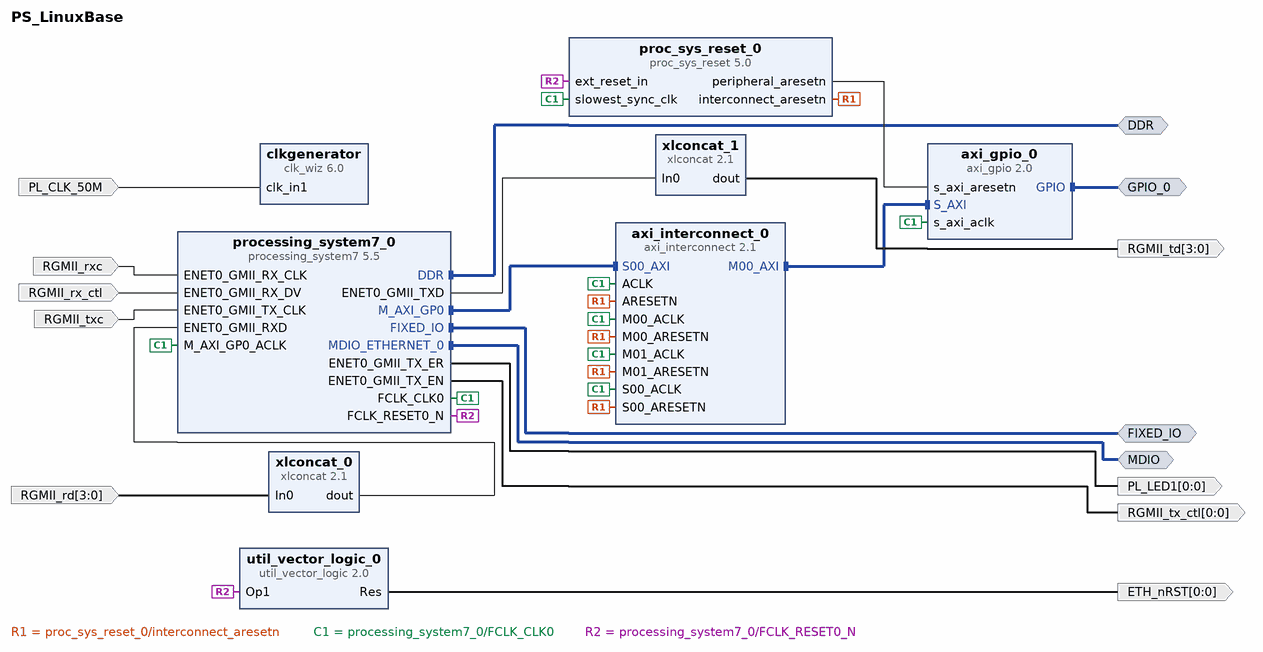
[diagram p0: block diagram of the top level]
# Vivado block design PS_LinuxBase, xc7z020clg400-2, Vivado 2022.1
create_bd_design PS_LinuxBase

create_bd_intf_port -mode Master -vlnv xilinx.com:interface:ddrx_rtl:1.0 DDR
create_bd_intf_port -mode Master -vlnv xilinx.com:display_processing_system7:fixedio_rtl:1.0 FIXED_IO
create_bd_intf_port -mode Master -vlnv xilinx.com:interface:mdio_rtl:1.0 MDIO
create_bd_intf_port -mode Master -vlnv xilinx.com:interface:gpio_rtl:1.0 GPIO_0
create_bd_port -dir I -type clk PL_CLK_50M
set_property -dict {CONFIG.ASSOCIATED_RESET ETH_nRST CONFIG.FREQ_HZ 50000000} [get_bd_ports PL_CLK_50M]
create_bd_port -dir O -from 0 -to 0 PL_LED1
create_bd_port -dir O -from 0 -to 0 -type rst ETH_nRST
create_bd_port -dir O -from 3 -to 0 RGMII_td
create_bd_port -dir I -type clk RGMII_txc
set_property -dict {CONFIG.FREQ_HZ 25000000} [get_bd_ports RGMII_txc]
create_bd_port -dir I RGMII_rx_ctl
create_bd_port -dir O -from 0 -to 0 RGMII_tx_ctl
create_bd_port -dir I -type clk RGMII_rxc
set_property -dict {CONFIG.FREQ_HZ 25000000} [get_bd_ports RGMII_rxc]
create_bd_port -dir I -from 3 -to 0 RGMII_rd

create_bd_cell -type ip -vlnv xilinx.com:ip:clk_wiz:6.0 clkgenerator
set_property -dict [list \
  CONFIG.CLKIN1_JITTER_PS 200.0 \
  CONFIG.CLKOUT1_DRIVES BUFG \
  CONFIG.CLKOUT1_JITTER 162.035 \
  CONFIG.CLKOUT1_PHASE_ERROR 164.985 \
  CONFIG.CLKOUT2_DRIVES BUFG \
  CONFIG.CLKOUT2_JITTER 154.207 \
  CONFIG.CLKOUT2_PHASE_ERROR 164.985 \
  CONFIG.CLKOUT2_REQUESTED_OUT_FREQ 125 \
  CONFIG.CLKOUT2_USED true \
  CONFIG.CLKOUT3_DRIVES BUFG \
  CONFIG.CLKOUT3_JITTER 142.107 \
  CONFIG.CLKOUT3_PHASE_ERROR 164.985 \
  CONFIG.CLKOUT3_REQUESTED_OUT_FREQ 200 \
  CONFIG.CLKOUT3_USED true \
  CONFIG.CLKOUT4_DRIVES BUFG \
  CONFIG.CLKOUT5_DRIVES BUFG \
  CONFIG.CLKOUT6_DRIVES BUFG \
  CONFIG.CLKOUT7_DRIVES BUFG \
  CONFIG.CLK_OUT1_PORT CLK_100M \
  CONFIG.CLK_OUT2_PORT CLK_125M \
  CONFIG.CLK_OUT3_PORT CLK_200M \
  CONFIG.FEEDBACK_SOURCE FDBK_AUTO \
  CONFIG.MMCM_BANDWIDTH OPTIMIZED \
  CONFIG.MMCM_CLKFBOUT_MULT_F 20.000 \
  CONFIG.MMCM_CLKIN1_PERIOD 20.000 \
  CONFIG.MMCM_CLKIN2_PERIOD 10.0 \
  CONFIG.MMCM_CLKOUT0_DIVIDE_F 10.000 \
  CONFIG.MMCM_CLKOUT1_DIVIDE 8 \
  CONFIG.MMCM_CLKOUT2_DIVIDE 5 \
  CONFIG.MMCM_COMPENSATION ZHOLD \
  CONFIG.NUM_OUT_CLKS 3 \
  CONFIG.PRIMITIVE MMCM \
  CONFIG.PRIM_IN_FREQ 50 \
  CONFIG.USE_RESET false \
] [get_bd_cells clkgenerator]
create_bd_cell -type ip -vlnv xilinx.com:ip:processing_system7:5.5 processing_system7_0
set_property -dict [list \
  CONFIG.PCW_ENET0_ENET0_IO EMIO \
  CONFIG.PCW_ENET0_GRP_MDIO_ENABLE 1 \
  CONFIG.PCW_ENET0_GRP_MDIO_IO EMIO \
  CONFIG.PCW_ENET0_PERIPHERAL_ENABLE 1 \
  CONFIG.PCW_ENET0_PERIPHERAL_FREQMHZ {100 Mbps} \
  CONFIG.PCW_ENET_RESET_ENABLE 0 \
  CONFIG.PCW_EN_CLK1_PORT 1 \
  CONFIG.PCW_EN_CLK2_PORT 1 \
  CONFIG.PCW_EN_CLK3_PORT 1 \
  CONFIG.PCW_FCLK_CLK1_BUF TRUE \
  CONFIG.PCW_FCLK_CLK2_BUF TRUE \
  CONFIG.PCW_FCLK_CLK3_BUF TRUE \
  CONFIG.PCW_FPGA0_PERIPHERAL_FREQMHZ 100 \
  CONFIG.PCW_FPGA1_PERIPHERAL_FREQMHZ 125 \
  CONFIG.PCW_FPGA2_PERIPHERAL_FREQMHZ 200 \
  CONFIG.PCW_FPGA3_PERIPHERAL_FREQMHZ 25 \
  CONFIG.PCW_FPGA_FCLK1_ENABLE 1 \
  CONFIG.PCW_FPGA_FCLK2_ENABLE 1 \
  CONFIG.PCW_FPGA_FCLK3_ENABLE 1 \
  CONFIG.PCW_GPIO_MIO_GPIO_ENABLE 1 \
  CONFIG.PCW_GPIO_MIO_GPIO_IO MIO \
  CONFIG.PCW_I2C_RESET_ENABLE 1 \
  CONFIG.PCW_IRQ_F2P_INTR 1 \
  CONFIG.PCW_PRESET_BANK1_VOLTAGE {LVCMOS 3.3V} \
  CONFIG.PCW_QSPI_GRP_SINGLE_SS_ENABLE 1 \
  CONFIG.PCW_QSPI_GRP_SINGLE_SS_IO {MIO 1 .. 6} \
  CONFIG.PCW_QSPI_PERIPHERAL_ENABLE 1 \
  CONFIG.PCW_QSPI_QSPI_IO {MIO 1 .. 6} \
  CONFIG.PCW_SD0_GRP_CD_ENABLE 0 \
  CONFIG.PCW_SD0_GRP_WP_ENABLE 0 \
  CONFIG.PCW_SD0_PERIPHERAL_ENABLE 1 \
  CONFIG.PCW_SD0_SD0_IO {MIO 40 .. 45} \
  CONFIG.PCW_SDIO_PERIPHERAL_FREQMHZ 100 \
  CONFIG.PCW_SINGLE_QSPI_DATA_MODE x4 \
  CONFIG.PCW_TTC0_PERIPHERAL_ENABLE 1 \
  CONFIG.PCW_TTC0_TTC0_IO EMIO \
  CONFIG.PCW_UART0_PERIPHERAL_ENABLE 1 \
  CONFIG.PCW_UART0_UART0_IO {MIO 14 .. 15} \
  CONFIG.PCW_UART_PERIPHERAL_FREQMHZ 100 \
  CONFIG.PCW_UIPARAM_DDR_BUS_WIDTH {16 Bit} \
  CONFIG.PCW_UIPARAM_DDR_MEMORY_TYPE {DDR 3 (Low Voltage)} \
  CONFIG.PCW_UIPARAM_DDR_PARTNO {MT41J256M16 RE-125} \
  CONFIG.PCW_UIPARAM_GENERATE_SUMMARY NONE \
  CONFIG.PCW_USB0_PERIPHERAL_ENABLE 1 \
  CONFIG.PCW_USB0_RESET_ENABLE 1 \
  CONFIG.PCW_USB0_RESET_IO {MIO 46} \
  CONFIG.PCW_USB0_USB0_IO {MIO 28 .. 39} \
  CONFIG.PCW_USB_RESET_ENABLE 1 \
  CONFIG.PCW_USB_RESET_SELECT {Share reset pin} \
  CONFIG.PCW_USE_FABRIC_INTERRUPT 1 \
] [get_bd_cells processing_system7_0]
# 220 more settings of processing_system7_0 are not shown: defaults, MIO pin electricals, DDR timing, and values the tool derives
create_bd_cell -type ip -vlnv xilinx.com:ip:util_vector_logic:2.0 util_vector_logic_0
set_property -dict {CONFIG.C_OPERATION not CONFIG.C_SIZE 1} [get_bd_cells util_vector_logic_0]
create_bd_cell -type ip -vlnv xilinx.com:ip:proc_sys_reset:5.0 proc_sys_reset_0
create_bd_cell -type ip -vlnv xilinx.com:ip:xlconcat:2.1 xlconcat_0
set_property -dict {CONFIG.IN0_WIDTH 4 CONFIG.IN1_WIDTH 4} [get_bd_cells xlconcat_0]
create_bd_cell -type ip -vlnv xilinx.com:ip:xlconcat:2.1 xlconcat_1
set_property -dict {CONFIG.IN0_WIDTH 4 CONFIG.IN1_WIDTH 4 CONFIG.NUM_PORTS 1} [get_bd_cells xlconcat_1]
create_bd_cell -type ip -vlnv xilinx.com:ip:axi_interconnect:2.1 axi_interconnect_0
create_bd_cell -type ip -vlnv xilinx.com:ip:axi_gpio:2.0 axi_gpio_0
set_property -dict [list \
  CONFIG.C_ALL_INPUTS 0 \
  CONFIG.C_ALL_OUTPUTS 0 \
  CONFIG.C_GPIO_WIDTH 2 \
  CONFIG.C_IS_DUAL 0 \
] [get_bd_cells axi_gpio_0]

# ---- connections ----

connect_bd_intf_net [get_bd_intf_ports GPIO_0] [get_bd_intf_pins axi_gpio_0/GPIO]
connect_bd_intf_net [get_bd_intf_pins axi_interconnect_0/M00_AXI] [get_bd_intf_pins axi_gpio_0/S_AXI]
connect_bd_intf_net [get_bd_intf_ports DDR] [get_bd_intf_pins processing_system7_0/DDR]
connect_bd_intf_net [get_bd_intf_ports FIXED_IO] [get_bd_intf_pins processing_system7_0/FIXED_IO]
connect_bd_intf_net [get_bd_intf_ports MDIO] [get_bd_intf_pins processing_system7_0/MDIO_ETHERNET_0]
connect_bd_intf_net [get_bd_intf_pins processing_system7_0/M_AXI_GP0] [get_bd_intf_pins axi_interconnect_0/S00_AXI]
connect_bd_net -net ENET0_GMII_RX_CLK_0_1 [get_bd_ports RGMII_rxc] [get_bd_pins processing_system7_0/ENET0_GMII_RX_CLK]
connect_bd_net -net ENET0_GMII_RX_DV_0_1 [get_bd_ports RGMII_rx_ctl] [get_bd_pins processing_system7_0/ENET0_GMII_RX_DV]
connect_bd_net -net ENET0_GMII_TX_CLK_0_1 [get_bd_ports RGMII_txc] [get_bd_pins processing_system7_0/ENET0_GMII_TX_CLK]
connect_bd_net -net In0_0_1 [get_bd_ports RGMII_rd] [get_bd_pins xlconcat_0/In0]
connect_bd_net -net clk_in1_0_1 [get_bd_ports PL_CLK_50M] [get_bd_pins clkgenerator/clk_in1]
connect_bd_net [get_bd_pins proc_sys_reset_0/interconnect_aresetn] \
  [get_bd_pins axi_interconnect_0/ARESETN] [get_bd_pins axi_interconnect_0/S00_ARESETN] \
  [get_bd_pins axi_interconnect_0/M00_ARESETN] [get_bd_pins axi_interconnect_0/M01_ARESETN]
connect_bd_net [get_bd_pins proc_sys_reset_0/peripheral_aresetn] [get_bd_pins axi_gpio_0/s_axi_aresetn]
connect_bd_net [get_bd_pins processing_system7_0/ENET0_GMII_TXD] [get_bd_pins xlconcat_1/In0]
connect_bd_net [get_bd_pins processing_system7_0/ENET0_GMII_TX_EN] [get_bd_ports RGMII_tx_ctl]
connect_bd_net [get_bd_pins processing_system7_0/ENET0_GMII_TX_ER] [get_bd_ports PL_LED1]
connect_bd_net [get_bd_pins processing_system7_0/FCLK_CLK0] \
  [get_bd_pins processing_system7_0/M_AXI_GP0_ACLK] [get_bd_pins proc_sys_reset_0/slowest_sync_clk] \
  [get_bd_pins axi_interconnect_0/ACLK] [get_bd_pins axi_gpio_0/s_axi_aclk] [get_bd_pins axi_interconnect_0/S00_ACLK] \
  [get_bd_pins axi_interconnect_0/M00_ACLK] [get_bd_pins axi_interconnect_0/M01_ACLK]
connect_bd_net [get_bd_pins processing_system7_0/FCLK_RESET0_N] [get_bd_pins util_vector_logic_0/Op1] [get_bd_pins proc_sys_reset_0/ext_reset_in]
connect_bd_net [get_bd_pins util_vector_logic_0/Res] [get_bd_ports ETH_nRST]
connect_bd_net [get_bd_pins xlconcat_0/dout] [get_bd_pins processing_system7_0/ENET0_GMII_RXD]
connect_bd_net [get_bd_pins xlconcat_1/dout] [get_bd_ports RGMII_td]
set_property PFM.AXI_PORT {M_AXI_GP1 {memport "M_AXI_GP" sptag "" memory "" is_range "false"}} [get_bd_cells processing_system7_0]
set_property PFM.CLOCK {FCLK_CLK0 {id "5" is_default "true" proc_sys_reset "/proc_sys_reset_0" status "fixed" freq_hz "100000000"}} [get_bd_cells processing_system7_0]

# ---- address map ----
assign_bd_address -offset 0x41200000 -range 64K -target_address_space [get_bd_addr_spaces processing_system7_0/Data] [get_bd_addr_segs axi_gpio_0/S_AXI/Reg]

validate_bd_design
save_bd_design
